# EAGLE design DEC_1_0 (EAGLE 8.3.2)
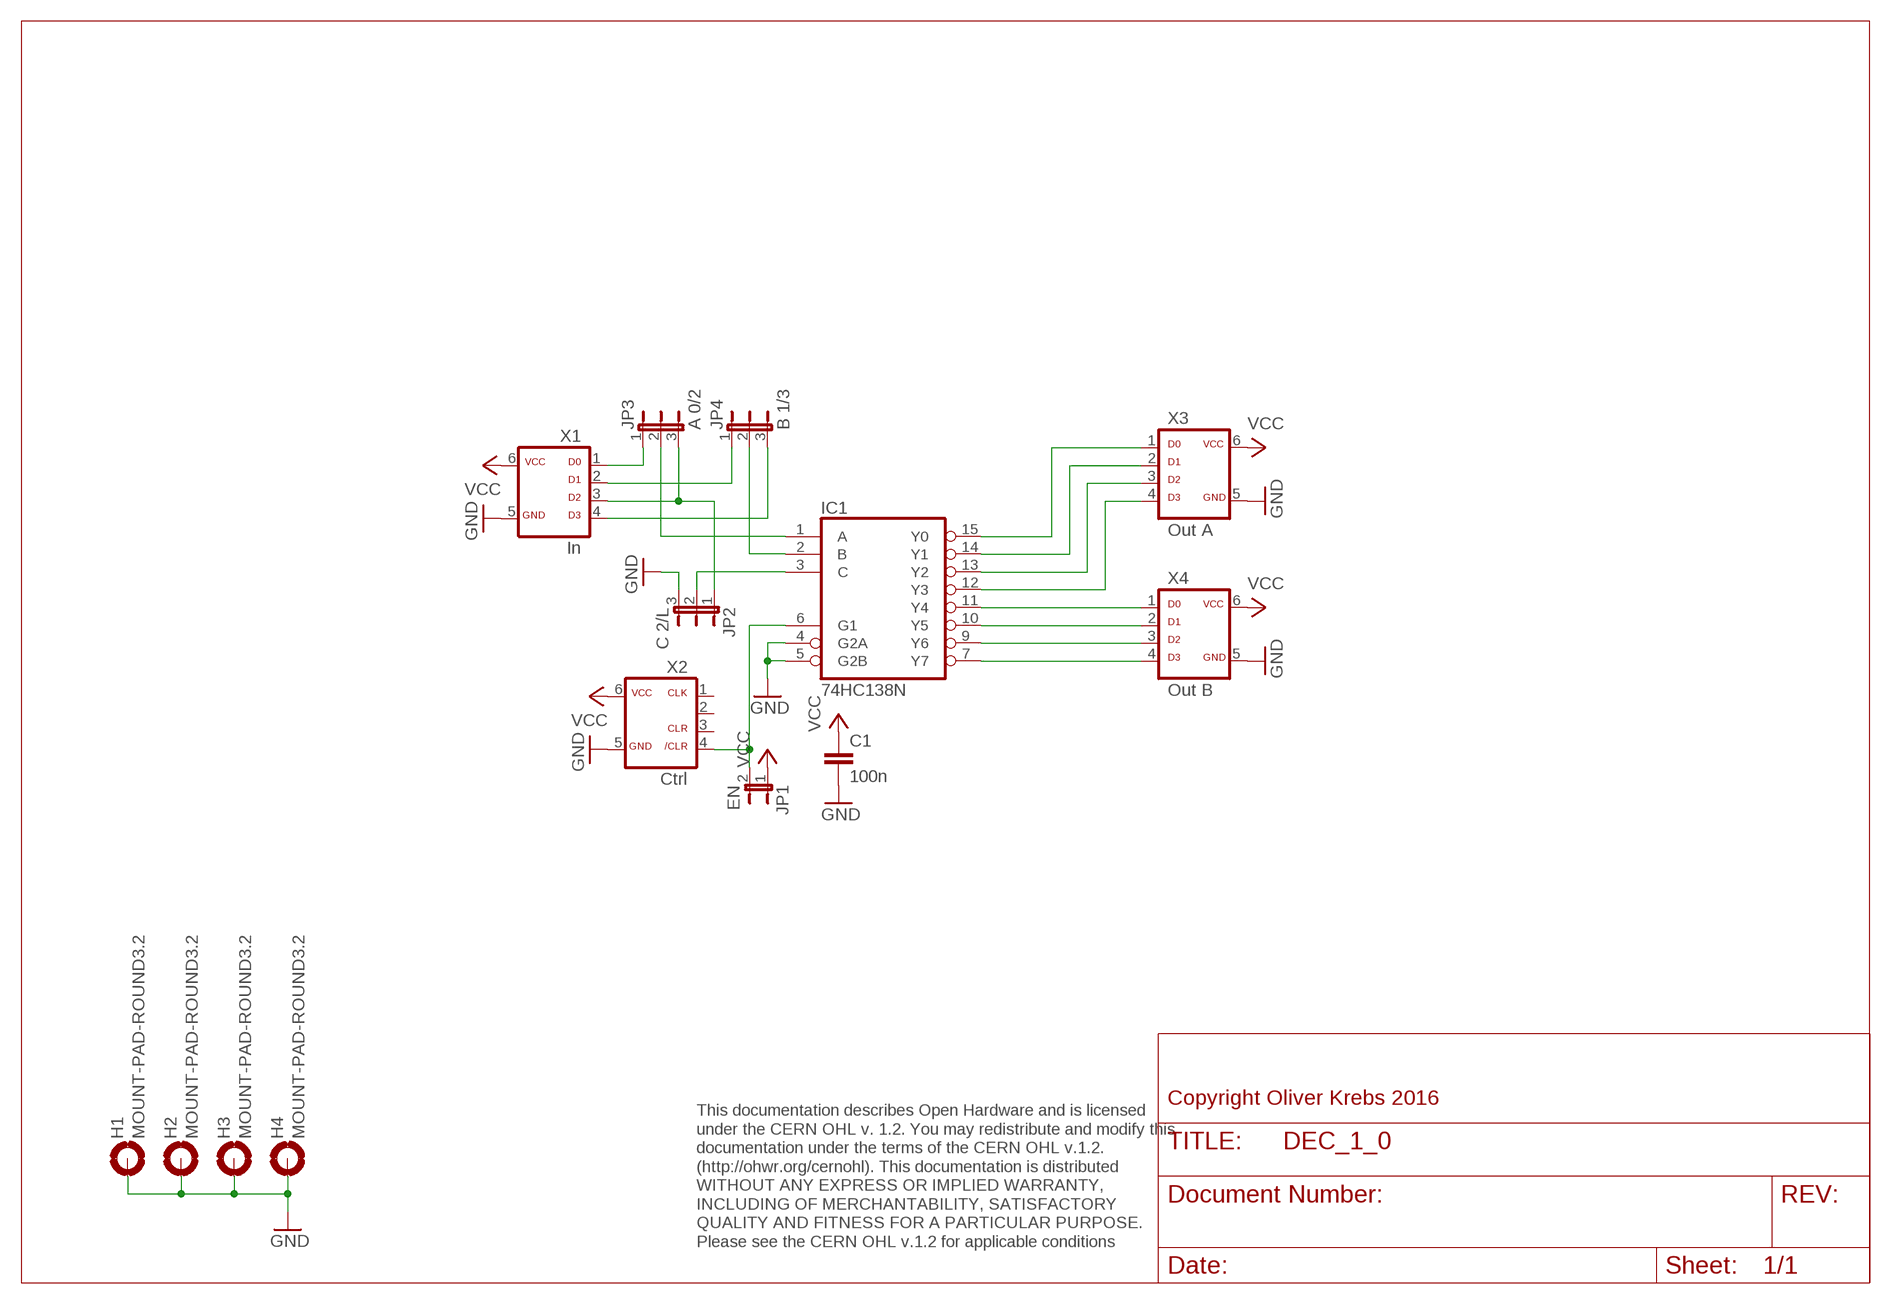
[diagram p0: schematic, sheet 1]

## Parts
C1  100n  C-EU050-025X075  [C050-025X075]
H1  MOUNT-PAD-ROUND3.2  [3,2-PAD]
H2  MOUNT-PAD-ROUND3.2  [3,2-PAD]
H3  MOUNT-PAD-ROUND3.2  [3,2-PAD]
H4  MOUNT-PAD-ROUND3.2  [3,2-PAD]
IC1  74HC138N  [DIL16]
JP1  EN  JP1E  [JP1]
JP2  C 2/L  JP2E  [JP2]
JP3  A 0/2  JP2E  [JP2]
JP4  B 1/3  JP2E  [JP2]
X1  In  ML6D  [ML-6]
X2  Ctrl  ML6C  [ML-6]
X3  Out A  ML6D  [ML-6]
X4  Out B  ML6D  [ML-6]

## Nets
GND: C1.2 H1.B3,2(MOUNT) H2.B3,2(MOUNT) H3.B3,2(MOUNT) H4.B3,2(MOUNT) IC1.4(G2A) IC1.5(G2B) JP2.3 X1.5 X2.5 X3.5 X4.5
N$1: IC1.1(A) JP3.2
N$2: IC1.2(B) JP4.2
N$3: IC1.3(C) JP2.2
N$4: IC1.15(Y0) X3.1
N$5: IC1.14(Y1) X3.2
N$6: IC1.13(Y2) X3.3
N$7: IC1.12(Y3) X3.4
N$8: IC1.11(Y4) X4.1
N$9: IC1.10(Y5) X4.2
N$10: IC1.9(Y6) X4.3
N$11: IC1.7(Y7) X4.4
N$12: IC1.6(G1) JP1.2 X2.4
N$17: JP2.1 JP3.3 X1.3
N$19: JP3.1 X1.1
N$20: JP4.1 X1.2
N$21: JP4.3 X1.4
VCC: C1.1 JP1.1 X1.6 X2.6 X3.6 X4.6
Unconnected: X2.1 X2.2 X2.3

## Notes on the sheet
- Copyright Oliver Krebs 2016
- This documentation describes Open Hardware and is licensed 
  under the CERN OHL v. 1.2. You may redistribute and modify this 
  documentation under the terms of the CERN OHL v.1.2. 
  (http://ohwr.org/cernohl). This documentation is distributed
  WITHOUT ANY EXPRESS OR IMPLIED WARRANTY, 
  INCLUDING OF MERCHANTABILITY, SATISFACTORY 
  QUALITY AND FITNESS FOR A PARTICULAR PURPOSE. 
  Please see the CERN OHL v.1.2 for applicable conditions

## Power pins joined to a net without a drawn wire
GND: IC1.8(GND)
VCC: IC1.16(VCC)

## Library data of the parts
C1 = 01-my_rcl:C-EU: CAPACITOR, European symbol
H1-H4 = holes:MOUNT-PAD-ROUND: MOUNTING PAD, round
IC1 = 74xx-eu:74*138: 3-line to 8-line DECODER/DEMULTIPLEXER
JP1 = jumper:JP1E: JUMPER
JP2-JP4 = jumper:JP2E: JUMPER
X1 X3 X4 = 01-my-con:ML6D
X2 = 01-my-con:ML6C

## Board
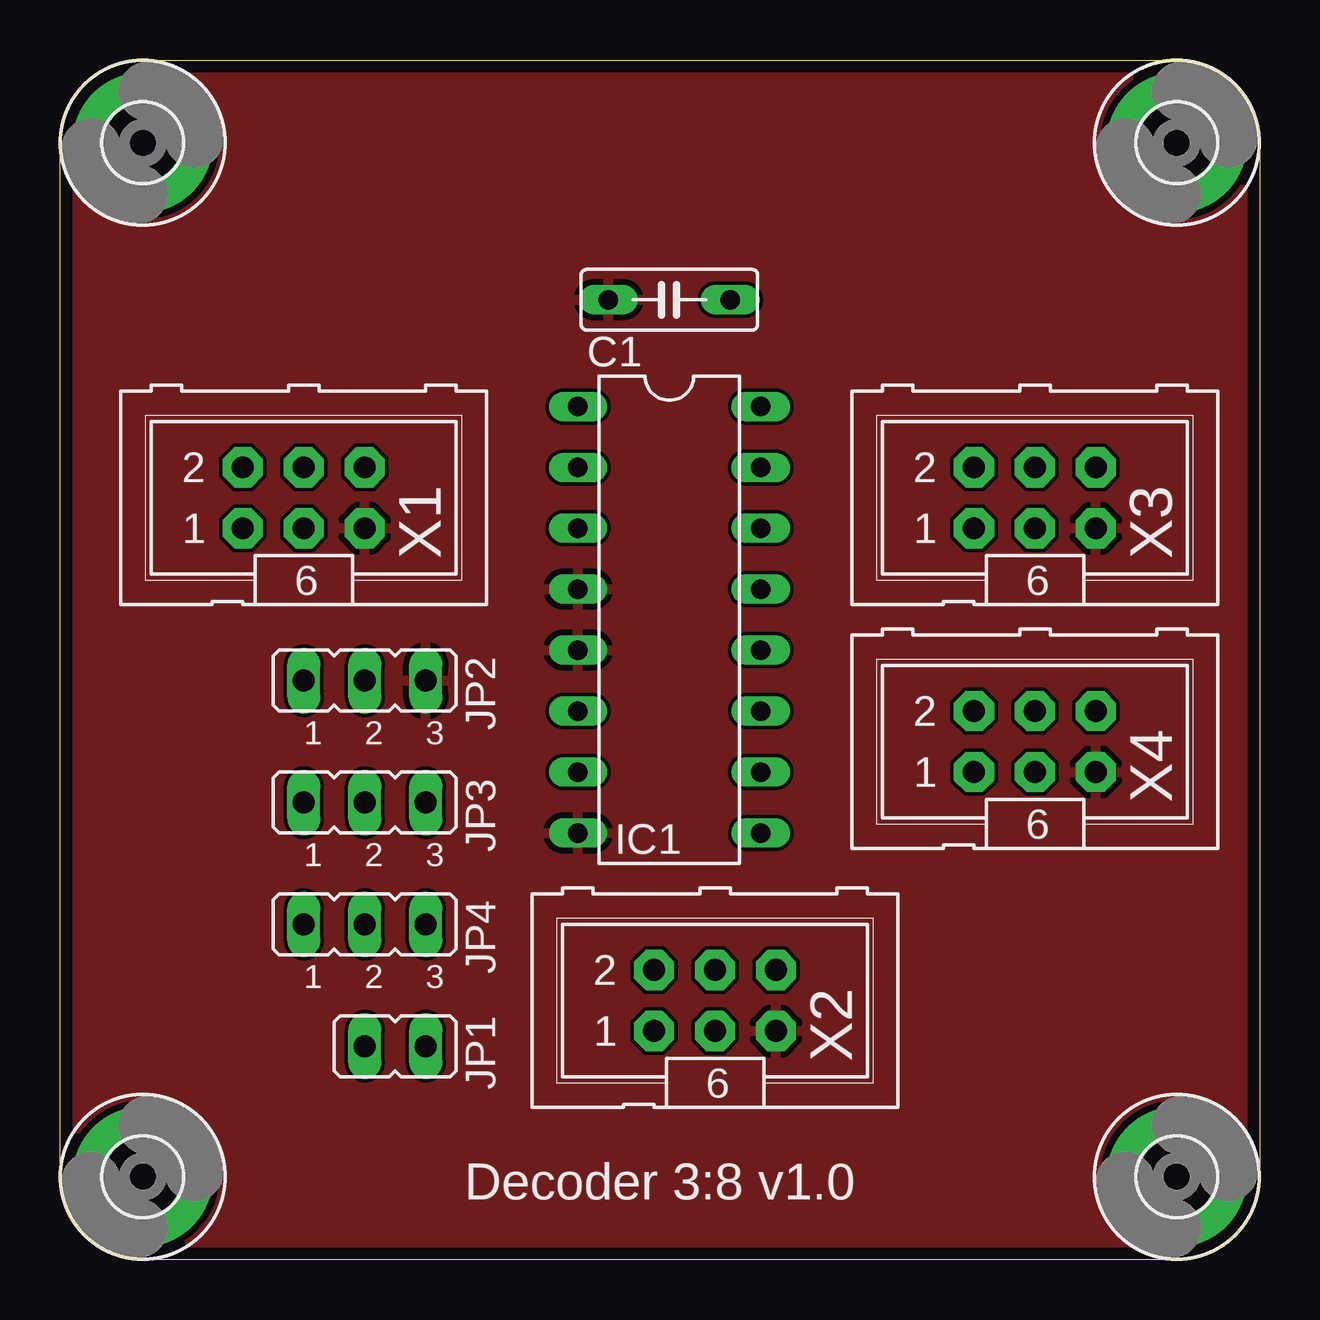
[diagram p1: board, top side]
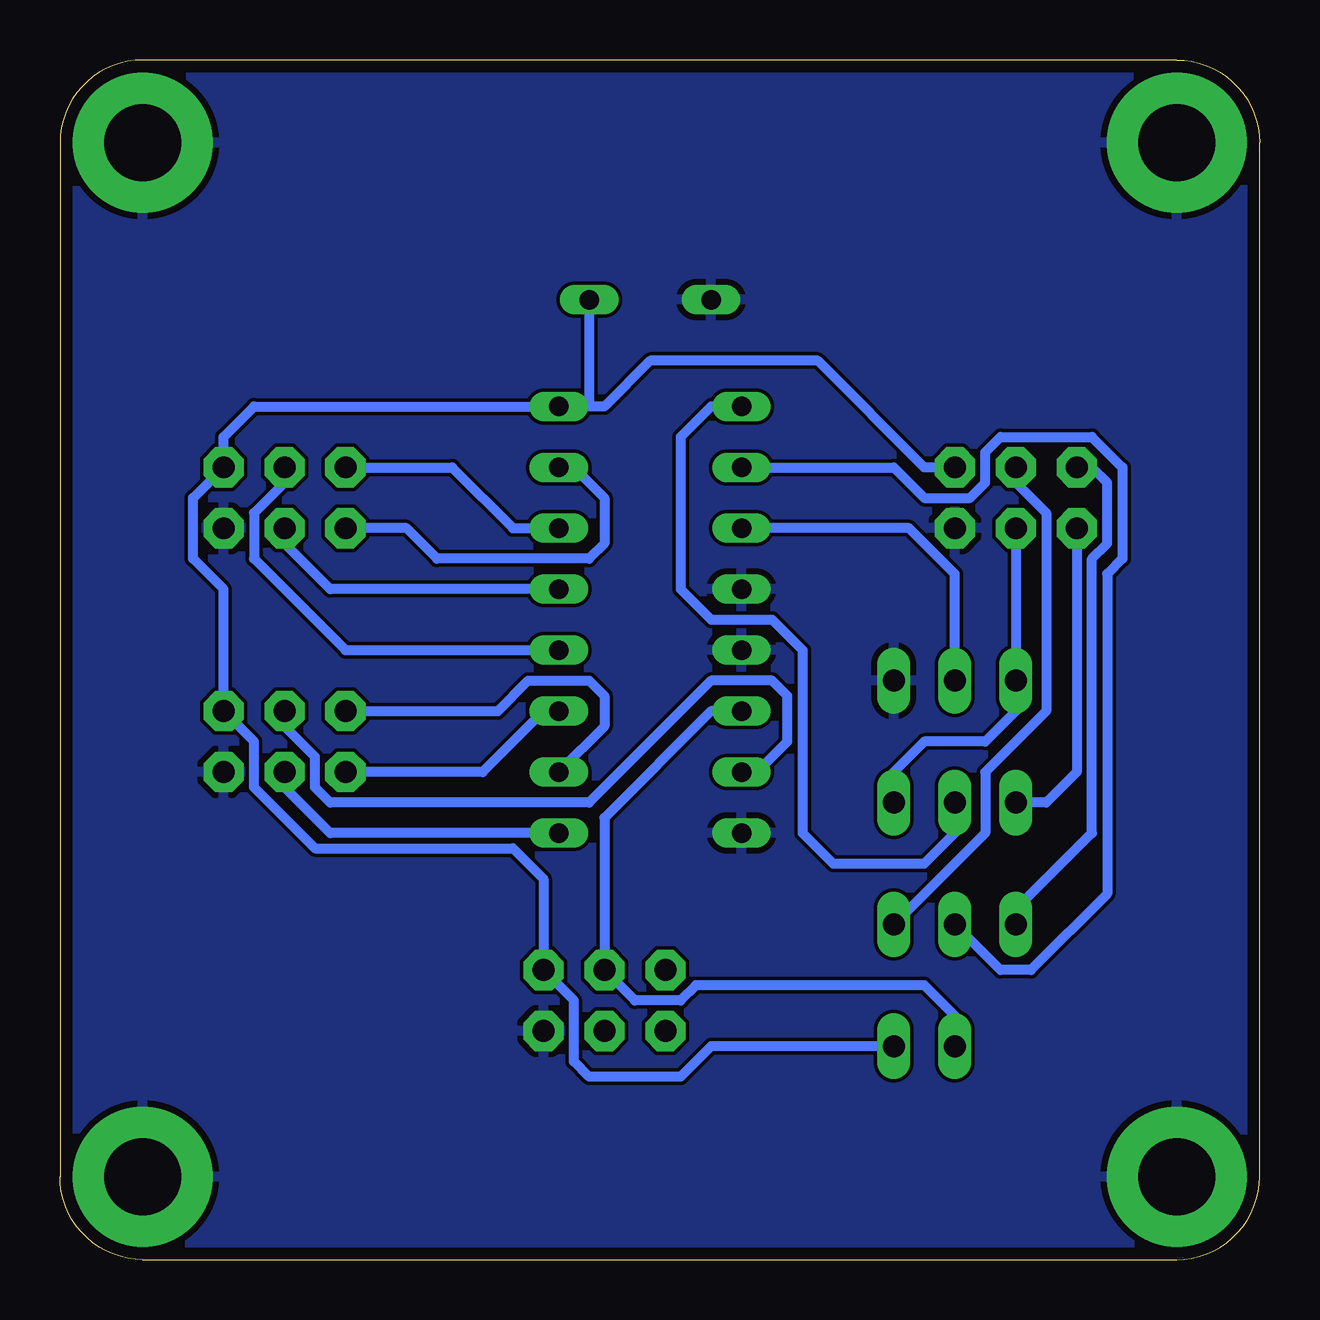
[diagram p2: board, bottom side, seen from below]

Size 50 x 50 mm. Coordinates in mm from the lower left corner, seen from the top.
Outline: 0,3.45 0,46.55 arc-90 3.45,50 46.55,50 arc-90 50,46.55 50,3.45 arc-90 46.55,0 3.45,0 arc-90 0,3.45
Copper layers (1*16): Top 0.035mm / dielectric 1.6mm / Bottom 0.035mm
Design rules "Elecrow_2-layer_PCB_eagle_rule": minimum track width 6mil, minimum drill 12mil, track to track 6mil, track to pad 6mil, pad to pad 6mil, via to via 8mil, smd to smd 0mil, copper to edge 20mil, drill to drill 10mil, minimum pad ring 6mil, minimum via ring 6mil, stop-mask expansion 0mil, vias tented up to drill 100mil, thermal gap 10mil

### Footprints (pad centres in the part's own frame; a part is rotated, then mirrored left to right if it is on the bottom)
C050-025X075 = drill 0.813 long: 1 -2.54,0; 2 2.54,0
3,2-PAD = drill 3.2 pad 5.842: B3,2 0,0
DIL16 = drill 0.813 long: 1 -8.89,-3.81; 2 -6.35,-3.81; 3 -3.81,-3.81; 4 -1.27,-3.81; 5 1.27,-3.81; 6 3.81,-3.81; 7 6.35,-3.81; 8 8.89,-3.81; 9 8.89,3.81; 10 6.35,3.81; 11 3.81,3.81; 12 1.27,3.81; 13 -1.27,3.81; 14 -3.81,3.81; 15 -6.35,3.81; 16 -8.89,3.81
JP1 = drill 0.914 long: 1 0,-1.27; 2 0,1.27
JP2 = drill 0.914 long: 1 -2.54,0; 2 0,0; 3 2.54,0
ML-6 = drill 0.914 pad 1.676 octagon: 1 -2.54,-1.27; 2 -2.54,1.27; 3 0,-1.27; 4 0,1.27; 5 2.54,-1.27; 6 2.54,1.27

### Placement (x,y rotation side)
C1  25.4,40.01 180 top
H1  3.45,3.45 0 top
H2  3.45,46.55 0 top
H3  46.55,46.55 0 top
H4  46.55,3.45 0 top
IC1  25.4,26.67 270 top
JP1  13.97,8.89 90 top
JP2  12.7,24.13 0 top
JP3  12.7,19.05 0 top
JP4  12.7,13.97 0 top
X1  10.16,31.75 0 top
X2  27.3,10.79 0 top
X3  40.64,31.75 0 top
X4  40.64,21.59 0 top

### Tracks (layer width: path | path; a pad name or v marks a point on that pad's centre or on a via)
GND
  pour Bottom: 0,50.16 50.16,50.16 50.16,0 0,0
  pour Top: 0,50.16 50.16,50.16 50.16,0 0,0
N$1
  Bottom 0.406: IC1.1 22.86,35.56 24.13,34.29 24.13,27.94 22.86,26.67 20.32,26.67 19.05,25.4 19.05,17.78 17.78,16.51 13.97,16.51 12.7,17.78 JP3.2
N$2
  Bottom 0.406: IC1.2 15.24,33.02 13.97,31.75 12.06,31.75 11.43,32.38 11.43,33.66 10.79,34.29 6.99,34.29 5.71,33.02 5.71,29.21 6.35,28.57 6.35,15.24 9.53,12.06 10.79,12.06 JP4.2
N$3
  Bottom 0.406: JP2.2 12.7,28.57 14.61,30.48 IC1.3
N$4
  Bottom 0.406: IC1.15 28.57,33.02 27.3,31.75 27.3,29.84 27.94,29.21 34.29,29.21 35.56,30.48 X3.1
N$5
  Bottom 0.406: X3.2 33.66,33.02 31.11,30.48 IC1.14
N$6
  Bottom 0.406: IC1.13 38.73,27.94 40.64,29.84 X3.3
N$7
  Bottom 0.406: X3.4 40.64,32.38 41.91,31.11 41.91,29.21 38.1,25.4 IC1.12
N$8
  Bottom 0.406: IC1.11 29.84,22.86 32.38,20.32 X4.1
N$9
  Bottom 0.406: X4.2 31.75,22.86 30.48,24.13 27.94,24.13 27.3,23.5 27.3,22.23 IC1.10
N$10
  Bottom 0.406: IC1.9 38.73,17.78 40.64,19.68 X4.3
N$11
  Bottom 0.406: IC1.7 20.95,20.32 19.68,21.59 19.68,23.5 20.32,24.13 22.86,24.13 27.94,19.05 38.73,19.05 39.37,19.68 39.37,20.95 40.64,22.23 X4.4
N$12
  Bottom 0.406: JP1.2 12.7,10.16 13.97,11.43 23.5,11.43 24.13,10.79 26.04,10.79 X2.4 27.3,18.41 22.86,22.86 IC1.6
N$17
  Bottom 0.406: X1.3 JP2.1 10.16,22.86 11.43,21.59 13.97,21.59 15.24,20.32 JP3.3
N$19
  Bottom 0.406: X1.1 7.62,20.32 8.89,19.05 JP3.1
N$20
  Bottom 0.406: JP4.1 10.16,14.61 6.99,17.78 6.99,29.21 6.35,29.84 6.35,32.38 6.99,33.02 X1.2
N$21
  Bottom 0.406: X1.4 10.16,32.38 8.89,31.11 8.89,22.86 11.43,20.32 11.43,17.78 JP4.3
VCC
  Bottom 0.406: X1.6 13.97,33.02 18.41,37.47 25.4,37.47 27.3,35.56 27.94,35.56 | JP1.1 22.86,8.89 24.13,7.62 27.94,7.62 28.57,8.26 28.57,10.79 X2.6 29.84,15.88 31.11,17.14 39.37,17.14 41.91,19.68 41.91,21.59 X4.6 43.18,27.94 44.45,29.21 44.45,31.75 X3.6 43.18,34.29 41.91,35.56 IC1.16 27.94,35.56 | C1.1 27.94,35.56

### Text on the board
tNames: Decoder 3:8 v1.0
200bmp: E:/Bilder/Elektronik/Modulion/Mexdulon/mexdulon_50x50_pcb.bmp